# Altium schematic sheet SOM.SchDoc: SOM
size Tabloid; ApprovedBy: NA; CompanyName: Cospan Design LLC; DrawnBy: David McCoy; Engineer: David McCoy; DocumentNumber: 2; Revision: A; SheetNumber: 2; SheetTotal: 18; Client: OSH; Project: Guppy Buddy; ProjectPrettyName: Guppy Buddy
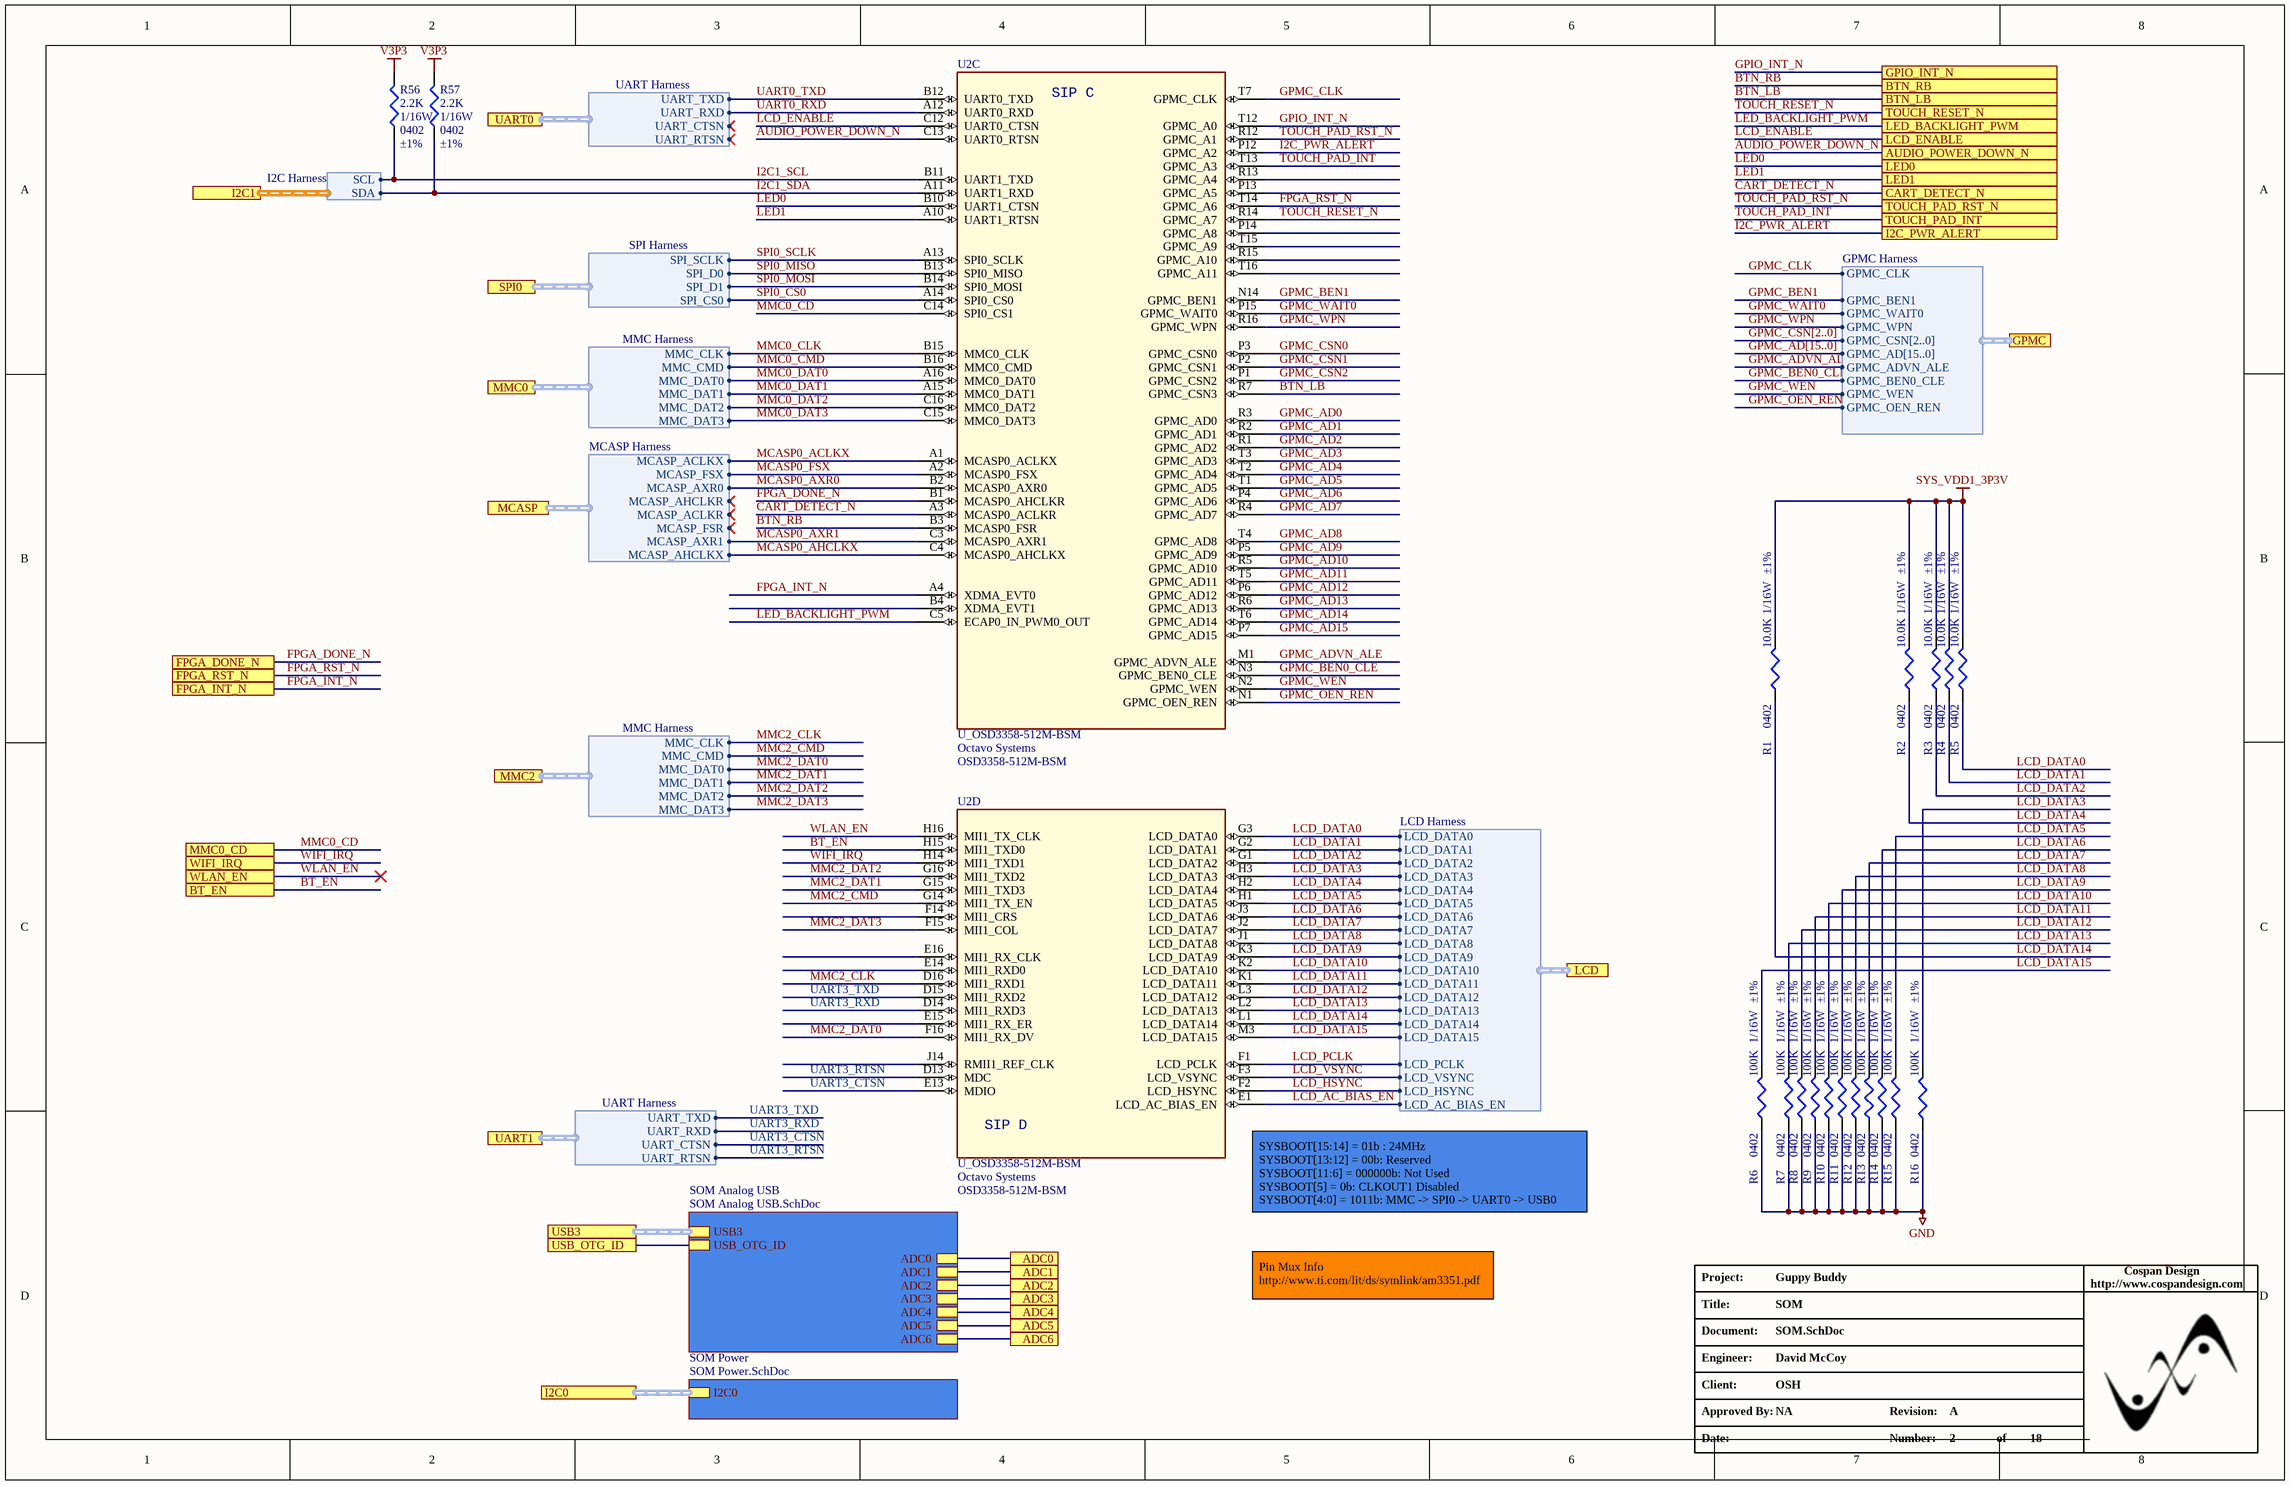
[diagram p0: SOM.SchDoc]

## Parts
R1  Resistance In Ohms: 10.0K  Power (Watts): 1/16W  Case: 0402  Tolerance: ±1%  [R_0402]  (hidden comment: R_0402_10.0K)
R2  Resistance In Ohms: 10.0K  Power (Watts): 1/16W  Case: 0402  Tolerance: ±1%  [R_0402]  (hidden comment: R_0402_10.0K)
R3  Resistance In Ohms: 10.0K  Power (Watts): 1/16W  Case: 0402  Tolerance: ±1%  [R_0402]  (hidden comment: R_0402_10.0K)
R4  Resistance In Ohms: 10.0K  Power (Watts): 1/16W  Case: 0402  Tolerance: ±1%  [R_0402]  (hidden comment: R_0402_10.0K)
R5  Resistance In Ohms: 10.0K  Power (Watts): 1/16W  Case: 0402  Tolerance: ±1%  [R_0402]  (hidden comment: R_0402_10.0K)
R6  Resistance In Ohms: 100K  Power (Watts): 1/16W  Case: 0402  Tolerance: ±1%  [R_0402]  (hidden comment: R_0402_100K)
R7  Resistance In Ohms: 100K  Power (Watts): 1/16W  Case: 0402  Tolerance: ±1%  [R_0402]  (hidden comment: R_0402_100K)
R8  Resistance In Ohms: 100K  Power (Watts): 1/16W  Case: 0402  Tolerance: ±1%  [R_0402]  (hidden comment: R_0402_100K)
R9  Resistance In Ohms: 100K  Power (Watts): 1/16W  Case: 0402  Tolerance: ±1%  [R_0402]  (hidden comment: R_0402_100K)
R10  Resistance In Ohms: 100K  Power (Watts): 1/16W  Case: 0402  Tolerance: ±1%  [R_0402]  (hidden comment: R_0402_100K)
R11  Resistance In Ohms: 100K  Power (Watts): 1/16W  Case: 0402  Tolerance: ±1%  [R_0402]  (hidden comment: R_0402_100K)
R12  Resistance In Ohms: 100K  Power (Watts): 1/16W  Case: 0402  Tolerance: ±1%  [R_0402]  (hidden comment: R_0402_100K)
R13  Resistance In Ohms: 100K  Power (Watts): 1/16W  Case: 0402  Tolerance: ±1%  [R_0402]  (hidden comment: R_0402_100K)
R14  Resistance In Ohms: 100K  Power (Watts): 1/16W  Case: 0402  Tolerance: ±1%  [R_0402]  (hidden comment: R_0402_100K)
R15  Resistance In Ohms: 100K  Power (Watts): 1/16W  Case: 0402  Tolerance: ±1%  [R_0402]  (hidden comment: R_0402_100K)
R16  Resistance In Ohms: 100K  Power (Watts): 1/16W  Case: 0402  Tolerance: ±1%  [R_0402]  (hidden comment: R_0402_100K)
R56  Resistance In Ohms: 2.2K  Power (Watts): 1/16W  Case: 0402  Tolerance: ±1%  [R_0402]  (hidden comment: R_0402_2.2K)
R57  Resistance In Ohms: 2.2K  Power (Watts): 1/16W  Case: 0402  Tolerance: ±1%  [R_0402]  (hidden comment: R_0402_2.2K)
U2  U_OSD3358-512M-BSM  Manufacturer 1: Octavo Systems  Manufacturer Part Number 1: OSD3358-512M-BSM  [OSD335X-BGA-256]  (parts C,D of 6)

## Sub-sheets
SOM Analog USB = SOM Analog USB.SchDoc: USB3 (harness USB3 Harness), ADC6, ADC1, ADC2, ADC4, ADC3, ADC5, ADC0, USB_OTG_ID
SOM Power = SOM Power.SchDoc: I2C0 (harness I2C Harness)

## Ports
ADC0, ADC1, ADC2, ADC3, ADC4, ADC5, ADC6, AUDIO_POWER_DOWN_N, BT_EN, BTN_LB, BTN_RB, CART_DETECT_N, FPGA_DONE_N, FPGA_INT_N, FPGA_RST_N, GPIO_INT_N, GPMC (harness GPMC Harness), I2C0 (harness I2C Harness), I2C1 (harness I2C Harness), I2C_PWR_ALERT, LCD (harness LCD Harness), LCD_ENABLE, LED0, LED1, LED_BACKLIGHT_PWM, MCASP (harness MCASP Harness), MMC0 (harness MMC Harness), MMC0_CD, MMC2 (harness MMC Harness), SPI0 (harness SPI Harness), TOUCH_PAD_INT, TOUCH_PAD_RST_N, TOUCH_RESET_N, UART0 (harness UART Harness), UART1 (harness UART Harness), USB3 (harness USB3 Harness), USB_OTG_ID, WIFI_IRQ, WLAN_EN

## Harnesses
LCD Harness: LCD_DATA0, LCD_DATA1, LCD_DATA2, LCD_DATA3, LCD_DATA4, LCD_DATA5, LCD_DATA6, LCD_DATA7, LCD_DATA8, LCD_DATA9, LCD_DATA10, LCD_DATA11, LCD_DATA12, LCD_DATA13, LCD_DATA14, LCD_DATA15, LCD_PCLK, LCD_VSYNC, LCD_HSYNC, LCD_AC_BIAS_EN
UART Harness: UART_TXD, UART_RXD, UART_CTSN, UART_RTSN
SPI Harness: SPI_SCLK, SPI_D0, SPI_D1, SPI_CS0
MMC Harness: MMC_CLK, MMC_CMD, MMC_DAT0, MMC_DAT1, MMC_DAT2, MMC_DAT3
MCASP Harness: MCASP_ACLKX, MCASP_FSX, MCASP_AXR0, MCASP_AHCLKR, MCASP_ACLKR, MCASP_FSR, MCASP_AXR1, MCASP_AHCLKX
I2C Harness: SCL, SDA
GPMC Harness: GPMC_CLK, GPMC_WPN, GPMC_AD[15..0], GPMC_ADVN_ALE, GPMC_BEN0_CLE, GPMC_WEN, GPMC_OEN_REN, GPMC_BEN1, GPMC_CSN[2..0], GPMC_WAIT0

## Nets
GND: R6.2 R7.2 R8.2 R9.2 R10.2 R11.2 R12.2 R13.2 R14.2 R15.2 R16.2
SYS_VDD1_3P3V: R1.2 R2.2 R3.2 R4.2 R5.2
V3P3: R56.1 R57.1
ADC0: port ADC0, sheet SOM Analog USB/ADC0
ADC1: port ADC1, sheet SOM Analog USB/ADC1
ADC2: port ADC2, sheet SOM Analog USB/ADC2
ADC3: port ADC3, sheet SOM Analog USB/ADC3
ADC4: port ADC4, sheet SOM Analog USB/ADC4
ADC5: port ADC5, sheet SOM Analog USB/ADC5
ADC6: port ADC6, sheet SOM Analog USB/ADC6
AUDIO_POWER_DOWN_N: U2.C13(UART0_RTSN) ; port AUDIO_POWER_DOWN_N
BT_EN: U2.H15(MII1_TXD0) ; port BT_EN
BTN_LB: U2.R7(GPMC_CSN3) ; port BTN_LB
BTN_RB: U2.B3(MCASP0_FSR) ; port BTN_RB
CART_DETECT_N: U2.A3(MCASP0_ACLKR) ; port CART_DETECT_N
FPGA_DONE_N: U2.B1(MCASP0_AHCLKR) ; port FPGA_DONE_N
FPGA_INT_N: U2.A4(XDMA_EVT0) ; port FPGA_INT_N
FPGA_RST_N: U2.T14(GPMC_A6) ; port FPGA_RST_N
GPIO_INT_N: U2.T12(GPMC_A0) ; port GPIO_INT_N
GPMC_AD0: U2.R3(GPMC_AD0)
GPMC_AD1: U2.R2(GPMC_AD1)
GPMC_AD2: U2.R1(GPMC_AD2)
GPMC_AD3: U2.T3(GPMC_AD3)
GPMC_AD4: U2.T2(GPMC_AD4)
GPMC_AD5: U2.T1(GPMC_AD5)
GPMC_AD6: U2.P4(GPMC_AD6)
GPMC_AD7: U2.R4(GPMC_AD7)
GPMC_AD8: U2.T4(GPMC_AD8)
GPMC_AD9: U2.P5(GPMC_AD9)
GPMC_AD10: U2.R5(GPMC_AD10)
GPMC_AD11: U2.T5(GPMC_AD11)
GPMC_AD12: U2.P6(GPMC_AD12)
GPMC_AD13: U2.R6(GPMC_AD13)
GPMC_AD14: U2.T6(GPMC_AD14)
GPMC_AD15: U2.P7(GPMC_AD15)
GPMC_ADVN_ALE: U2.M1(GPMC_ADVN_ALE) ; port GPMC.GPMC_ADVN_ALE
GPMC_BEN0_CLE: U2.N3(GPMC_BEN0_CLE) ; port GPMC.GPMC_BEN0_CLE
GPMC_BEN1: U2.N14(GPMC_BEN1) ; port GPMC.GPMC_BEN1
GPMC_CLK: U2.T7(GPMC_CLK) ; port GPMC.GPMC_CLK
GPMC_CSN0: U2.P3(GPMC_CSN0)
GPMC_CSN1: U2.P2(GPMC_CSN1)
GPMC_CSN2: U2.P1(GPMC_CSN2)
GPMC_OEN_REN: U2.N1(GPMC_OEN_REN) ; port GPMC.GPMC_OEN_REN
GPMC_WAIT0: U2.P15(GPMC_WAIT0) ; port GPMC.GPMC_WAIT0
GPMC_WEN: U2.N2(GPMC_WEN) ; port GPMC.GPMC_WEN
GPMC_WPN: U2.R16(GPMC_WPN) ; port GPMC.GPMC_WPN
I2C1_SCL: R56.2 U2.B11(UART1_TXD) ; port I2C1.SCL
I2C1_SDA: R57.2 U2.A11(UART1_RXD) ; port I2C1.SDA
I2C_PWR_ALERT: U2.P12(GPMC_A2) ; port I2C_PWR_ALERT
LCD_AC_BIAS_EN: U2.E1(LCD_AC_BIAS_EN) ; port LCD.LCD_AC_BIAS_EN
LCD_DATA0: R5.1 U2.G3(LCD_DATA0) ; port LCD.LCD_DATA0
LCD_DATA1: R4.1 U2.G2(LCD_DATA1) ; port LCD.LCD_DATA1
LCD_DATA2: R3.1 U2.G1(LCD_DATA2) ; port LCD.LCD_DATA2
LCD_DATA3: R16.1 U2.H3(LCD_DATA3) ; port LCD.LCD_DATA3
LCD_DATA4: R2.1 U2.H2(LCD_DATA4) ; port LCD.LCD_DATA4
LCD_DATA5: R15.1 U2.H1(LCD_DATA5) ; port LCD.LCD_DATA5
LCD_DATA6: R14.1 U2.J3(LCD_DATA6) ; port LCD.LCD_DATA6
LCD_DATA7: R13.1 U2.J2(LCD_DATA7) ; port LCD.LCD_DATA7
LCD_DATA8: R12.1 U2.J1(LCD_DATA8) ; port LCD.LCD_DATA8
LCD_DATA9: R11.1 U2.K3(LCD_DATA9) ; port LCD.LCD_DATA9
LCD_DATA10: R10.1 U2.K2(LCD_DATA10) ; port LCD.LCD_DATA10
LCD_DATA11: R9.1 U2.K1(LCD_DATA11) ; port LCD.LCD_DATA11
LCD_DATA12: R8.1 U2.L3(LCD_DATA12) ; port LCD.LCD_DATA12
LCD_DATA13: R7.1 U2.L2(LCD_DATA13) ; port LCD.LCD_DATA13
LCD_DATA14: R1.1 U2.L1(LCD_DATA14) ; port LCD.LCD_DATA14
LCD_DATA15: R6.1 U2.M3(LCD_DATA15) ; port LCD.LCD_DATA15
LCD_ENABLE: U2.C12(UART0_CTSN) ; port LCD_ENABLE
LCD_HSYNC: U2.F2(LCD_HSYNC) ; port LCD.LCD_HSYNC
LCD_PCLK: U2.F1(LCD_PCLK) ; port LCD.LCD_PCLK
LCD_VSYNC: U2.F3(LCD_VSYNC) ; port LCD.LCD_VSYNC
LED0: U2.B10(UART1_CTSN) ; port LED0
LED1: U2.A10(UART1_RTSN) ; port LED1
LED_BACKLIGHT_PWM: U2.C5(ECAP0_IN_PWM0_OUT) ; port LED_BACKLIGHT_PWM
MCASP0_ACLKX: U2.A1(MCASP0_ACLKX) ; port MCASP.MCASP_ACLKX
MCASP0_AHCLKX: U2.C4(MCASP0_AHCLKX) ; port MCASP.MCASP_AHCLKX
MCASP0_AXR0: U2.B2(MCASP0_AXR0) ; port MCASP.MCASP_AXR0
MCASP0_AXR1: U2.C3(MCASP0_AXR1) ; port MCASP.MCASP_AXR1
MCASP0_FSX: U2.A2(MCASP0_FSX) ; port MCASP.MCASP_FSX
MMC0_CD: U2.C14(SPI0_CS1) ; port MMC0_CD
MMC0_CLK: U2.B15(MMC0_CLK) ; port MMC0.MMC_CLK
MMC0_CMD: U2.B16(MMC0_CMD) ; port MMC0.MMC_CMD
MMC0_DAT0: U2.A16(MMC0_DAT0) ; port MMC0.MMC_DAT0
MMC0_DAT1: U2.A15(MMC0_DAT1) ; port MMC0.MMC_DAT1
MMC0_DAT2: U2.C16(MMC0_DAT2) ; port MMC0.MMC_DAT2
MMC0_DAT3: U2.C15(MMC0_DAT3) ; port MMC0.MMC_DAT3
MMC2_CLK: U2.D16(MII1_RXD1) ; port MMC2.MMC_CLK
MMC2_CMD: U2.G14(MII1_TX_EN) ; port MMC2.MMC_CMD
MMC2_DAT0: U2.F16(MII1_RX_DV) ; port MMC2.MMC_DAT0
MMC2_DAT1: U2.G15(MII1_TXD3) ; port MMC2.MMC_DAT1
MMC2_DAT2: U2.G16(MII1_TXD2) ; port MMC2.MMC_DAT2
MMC2_DAT3: U2.F15(MII1_COL) ; port MMC2.MMC_DAT3
SPI0_CS0: U2.A14(SPI0_CS0) ; port SPI0.SPI_CS0
SPI0_MISO: U2.B13(SPI0_MISO) ; port SPI0.SPI_D0
SPI0_MOSI: U2.B14(SPI0_MOSI) ; port SPI0.SPI_D1
SPI0_SCLK: U2.A13(SPI0_SCLK) ; port SPI0.SPI_SCLK
TOUCH_PAD_INT: U2.T13(GPMC_A3) ; port TOUCH_PAD_INT
TOUCH_PAD_RST_N: U2.R12(GPMC_A1) ; port TOUCH_PAD_RST_N
TOUCH_RESET_N: U2.R14(GPMC_A7) ; port TOUCH_RESET_N
UART0_RXD: U2.A12(UART0_RXD) ; port UART0.UART_RXD
UART0_TXD: U2.B12(UART0_TXD) ; port UART0.UART_TXD
UART3_CTSN: U2.E13(MDIO) ; port UART1.UART_CTSN
UART3_RTSN: U2.D13(MDC) ; port UART1.UART_RTSN
UART3_RXD: U2.D14(MII1_RXD3) ; port UART1.UART_RXD
UART3_TXD: U2.D15(MII1_RXD2) ; port UART1.UART_TXD
USB_OTG_ID: port USB_OTG_ID, sheet SOM Analog USB/USB_OTG_ID
WIFI_IRQ: U2.H14(MII1_TXD1) ; port WIFI_IRQ
WLAN_EN: U2.H16(MII1_TX_CLK) ; port WLAN_EN

Not connected (* = marked no-connect by the designer): U2 B4(XDMA_EVT1) E14(MII1_RXD0) E15(MII1_RX_ER) E16(MII1_RX_CLK) F14(MII1_CRS) J14(RMII1_REF_CLK) P13(GPMC_A5) P14(GPMC_A8) R13(GPMC_A4) R15(GPMC_A10) T15(GPMC_A9) T16(GPMC_A11)

## Buses and harness runs
bus GPMC_AD[15..0]
bus GPMC_CSN[2..0]
harness port I2C0 = sheet SOM Power/I2C0
harness port USB3 = sheet SOM Analog USB/USB3

## Notes on the sheet
- (near U2) SYSBOOT[15:14] = 01b : 24MHz
  SYSBOOT[13:12] = 00b: Reserved
  SYSBOOT[11:6] = 000000b: Not Used
  SYSBOOT[5] = 0b: CLKOUT1 Disabled
  SYSBOOT[4:0] = 1011b: MMC -> SPI0 -> UART0 -> USB0
- Pin Mux Info
  http://www.ti.com/lit/ds/symlink/am3351.pdf
- Project:
- http://www.cospandesign.com
- Cospan Design
- Document:
- Engineer:
- Title:
- Client:
- Approved By:
- Revision:
- Date:
- Number:
- of
- (in symbol U_OSD3358-512M-BSM, part C) SIP C
- (in symbol U_OSD3358-512M-BSM, part D) SIP D

## Library data of the parts
R1-R5 = R_0402_10.0K: RES 10.0K OHM 1/16W 1% 0402 SMD; Manufacturer: Stackpole Electronics Inc; Manufacturer Part Number: RMCF0402FT10K0; Resistance (Ohms): 10k; Temperature Coefficient: ±100ppm/°C; Supplier 1: Digi-Key; Supplier Part Number 1: RMCF0402FT10K0CT-ND; RoHS: RoHS Compliant; Category: Resistors; Stock 1: 234525; Pricing: 1=0.04, 10=0.025, 50=0.0138, 100=0.0105, 250=0.0078, 500=0.00576, 1000=0.00384, 2500=0.00324, 5000=0.0027 (USD); Composition: Thick Film; Features: -; Package / Case: 0402 (1005 Metric); Size / Dimension: 0.039" L x 0.020" W (1.00mm x 0.50mm); Height: 0.016" (0.40mm); Number of Terminations: 2; Packaging: Cut Tape (CT); ComponentLink1URL: http://www.seielect.com/Catalog/SEI-RMCF_RMCP.pdf; ComponentLink1Description: http://www.seielect.com/Catalog/SEI-RMCF_RMCP.pdf
R6-R16 = R_0402_100K: RES SMD 100K OHM 1% 1/16W 0402; Manufacturer: Yageo; Manufacturer Part Number: RC0402FR-07100KL; Temperature Coefficient: ±100ppm/°C; Supplier 1: Digi-Key; RoHS: RoHS Compliant; Category: Resistors; Stock 1: 4989982; Pricing 1: 1=0.1, 10=0.013, 25=0.0096, 100=0.0054, 250=0.00412, 500=0.00328, 1000=0.00242, 2500=0.0021, 5000=0.00173 (USD); Packaging: Cut Tape (CT); Resistance (Ohms): 100k; Composition: Thick Film; Features: Moisture Resistant; Operating Temperature: -55°C ~ 155°C; Package / Case: 0402 (1005 Metric); Supplier Device Package: 0402; Size / Dimension: 0.039" L x 0.020" W (1.00mm x 0.50mm); Height: 0.016" (0.40mm); Number of Terminations: 2; ComponentLink1URL: http://www.yageo.com/NewPortal/yageodocoutput?fileName=/pdf/R-Chip/PYu-RC_Group_51_RoHS_L_3.pdf; ComponentLink1Description: http://www.yageo.com/NewPortal/yageodocoutput?fileName=/pdf/R-Chip/PYu-RC_Group_51_RoHS_L_3.pdf; Supplier Part Number 1: 311-100KLRCT-ND
R56 R57 = R_0402_2.2K: RES SMD 2.2K OHM 1% 1/10W 0402; Manufacturer: Panasonic Electronic Components; Manufacturer Part Number: ERJ-2RKF2201X; Temperature Coefficient: ±100ppm/°C; Supplier 1: Digi-Key; RoHS: RoHS Compliant; Category: Resistors; Stock 1: 1256647; Pricing 1: 1=0.1, 50=0.015, 100=0.011, 250=0.0084, 500=0.00674, 1000=0.00496, 5000=0.00355 (USD); Packaging: Cut Tape (CT); Resistance (Ohms): 2.2k; Composition: Thick Film; Features: Automotive AEC-Q200; Operating Temperature: -55°C ~ 155°C; Package / Case: 0402 (1005 Metric); Supplier Device Package: 0402; Size / Dimension: 0.039" L x 0.020" W (1.00mm x 0.50mm); Height: 0.016" (0.40mm); Number of Terminations: 2; ComponentLink1URL: http://industrial.panasonic.com/www-cgi/jvcr13pz.cgi?E+PZ+3+AOA0002+ERJ2RKF2201X+7+WW; ComponentLink1Description: http://industrial.panasonic.com/www-cgi/jvcr13pz.cgi?E+PZ+3+AOA0002+ERJ2RKF2201X+7+WW; Supplier Part Number 1: P2.20KLCT-ND
U2 = U_OSD3358-512M-BSM: Supplier 1: Digi-Key; Supplier Part Number 1: 1676-1002-ND; Stock 1: 592; Pricing 1: 1=43.73, 10=41.08, 100=36.84 (USD)